# Altium schematic sheet OLED.SchDoc
size A4; SheetNumber: 3; SheetTotal: 4
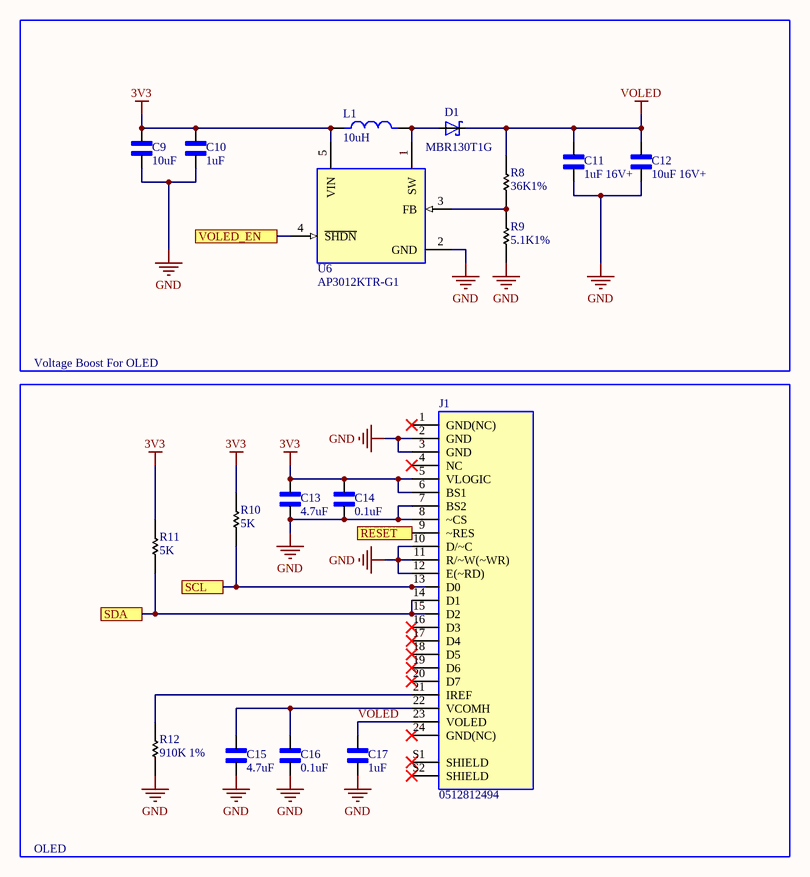
[diagram p0: OLED.SchDoc]

## Parts
C9  10uF  [CHIP_0603]
C10  1uF  [CHIP_0603]
C11  1uF 16V+  [CHIP_0603]
C12  10uF 16V+  [CHIP_0603]
C13  4.7uF  [CHIP_0603]
C14  0.1uF  [CHIP_0603]
C15  4.7uF  [CHIP_0603]
C16  0.1uF  [CHIP_0603]
C17  1uF  [CHIP_0603]
D1  MBR130T1G  [SOD-123-2]
J1  0512812494  [Top_Connector_Config_0512812494]
L1  10uH  [IND_LQH3NPZ100MMEL]
R8  36K1%  [CHIP_R_0603]
R9  5.1K1%  [CHIP_R_0603]
R10  5K  [CHIP_R_0603]
R11  5K  [CHIP_R_0603]
R12  910K 1%  [CHIP_R_0603]
U6  AP3012KTR-G1  [SOT-23]

## Blocks framed on the sheet
Voltage Boost For OLED: C9-C12 D1 L1 R8 R9 U6
OLED: C13-C17 J1 R10-R12

## Ports
RESET, SCL, SDA, VOLED_EN

## Nets
3V3: C9.1 C10.1 C13.1 C14.1 J1.5(VLOGIC) J1.6(BS1) L1.1 R10.1 R11.1 U6.5(VIN)
GND: C9.2 C10.2 C11.2 C12.2 C13.2 C14.2 C15.2 C16.2 C17.2 J1.2(GND) J1.3(GND) J1.7(BS2) J1.8(~CS) J1.10(D/~C) J1.11(R/~W(~WR)) J1.12(E(~RD)) R9.2 R12.2 U6.2(GND)
VOLED: C11.1 C12.1 C17.1 D1.C J1.23(VOLED) R8.1
RESET: J1.9(~RES) ; port RESET
SCL: J1.13(D0) R10.2 ; port SCL
SDA: J1.14(D1) J1.15(D2) R11.2 ; port SDA
VOLED_EN: U6.4(~{SHDN}) ; port VOLED_EN
NetC15_1: C15.1 C16.1 J1.22(VCOMH)
NetD1_A: D1.A L1.2 U6.1(SW)
NetJ1_21: J1.21(IREF) R12.1
NetR8_2: R8.2 R9.1 U6.3(FB)

Not connected (* = marked no-connect by the designer): J1 1(GND(NC))* 4(NC)* 16(D3)* 17(D4)* 18(D5)* 19(D6)* 20(D7)* 24(GND(NC))* S1(SHIELD)* S2(SHIELD)*

## Library data of the parts
C9-C17 = 0603 Ceramic Capacitor: Generic 0603 Ceramic Capacitor; MP: AC0402FR-071ML; MF: Yageo; Package: 1005 Yageo; SnapEDA_Link: https://www.snapeda.com/parts/AC0402FR-071ML/Yageo/view-part/940461/?ref=snap; Value: *; Mouser-Purchase-URL: https://snapeda.com/shop?store=Mouser&id=940461; DigiKey-Purchase-URL: https://snapeda.com/shop?store=DigiKey&id=940461
D1 = MBR130T1G: Diode Schottky 30 V 1A Surface Mount SOD-123; MP: MBR0530; MF: ON Semiconductor; Arrow_Electronics-Purchase-URL: https://snapeda.com/shop?store=Arrow+Electronics&id=2580921; Price: None; Package: SOD-123 Diodes Inc.; Value: *; DigiKey-Purchase-URL: https://snapeda.com/shop?store=DigiKey&id=2580921; Availability: Good; Mouser-Purchase-URL: https://snapeda.com/shop?store=Mouser&id=2580921; SnapEDA_Link: https://www.snapeda.com/parts/MBR0530/ON%20Semiconductor/view-part/2580921/?ref=snap
J1 = 0512812494: 24 Position FFC, FPC Connector Contacts, Top and Bottom 0.020" (0.50mm) Surface Mount, Right Angle; MP: 2-84952-4; MF: TE Connectivity; Package: None; EU_RoHS_Compliance: Compliant; Availability: Unavailable; Price: None; Value: *; SnapEDA_Link: https://www.snapeda.com/parts/2-84952-4/TE%20Connectivity/view-part/1466414/?ref=snap
L1 = LQH3NPZ100MMEL: Inductor with Inductance: 10uH Tol. +/-20%, Package: 1212 _3030_; MF: Murata; Package: 1212 Murata; MP: LQH3NPZ100MMEL; Digi-Key_Purchase_URL: https://www.digikey.com/product-detail/en/murata-electronics/LQH3NPZ100MMEL/490-15968-1-ND/6800633?utm_source=snapeda&utm_medium=aggregator&utm_campaign=symbol; Digi-Key_Part_Number: 490-15968-1-ND; Value: *; SnapEDA_Link: https://www.snapeda.com/parts/LQH3NPZ100MMEL/Murata/view-part/4547346/?ref=snap
R8-R12 = 0603 Generic Resistor: Generic 0603 Resistor
U6 = AP3012KTR-G1: Boost Switching Regulator IC Positive Adjustable 1.25V 1 Output 500mA _Switch_ SC-74A, SOT-753; MF: Diodes Inc.; Package: SOT-23-5 Diodes Inc.; MP: AP3012KTR-G1; Value: *; Availability: Unavailable; SnapEDA_Link: https://www.snapeda.com/parts/AP3012KTR-G1/Diodes%20Inc./view-part/587030/?ref=snap; Price: None